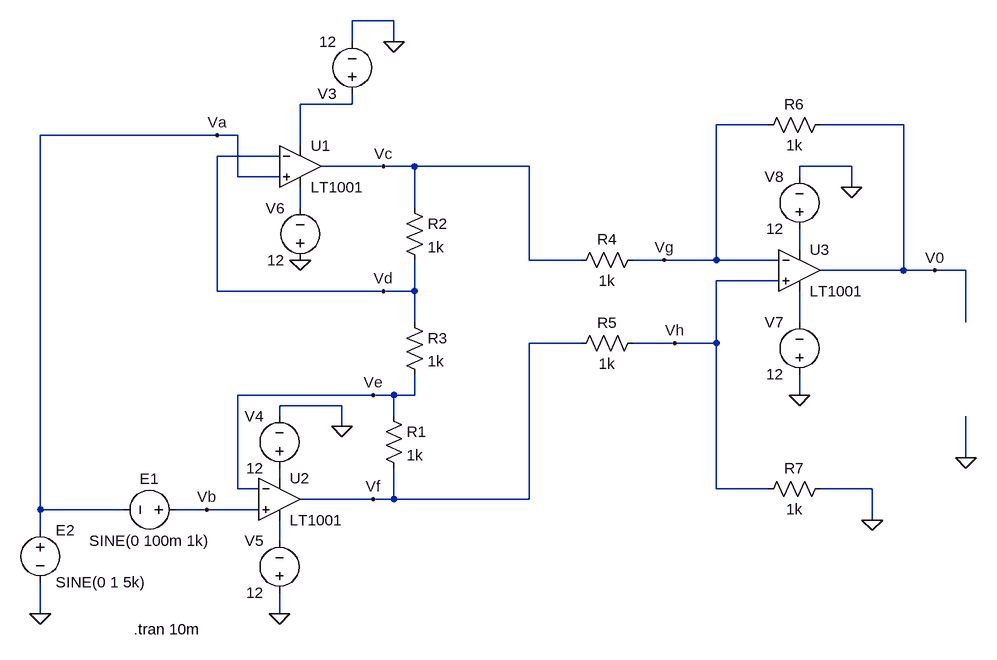
[diagram p0: schematic expt7_EEE270_AC.asc]
expt7_EEE270_AC.asc, the LTspice schematic file:
Version 4
SHEET 1 1332 680
WIRE 432 -384 368 -384
WIRE 368 -352 368 -384
WIRE 432 -352 432 -384
WIRE 368 -256 368 -272
WIRE 368 -256 288 -256
WIRE 1008 -224 928 -224
WIRE 1216 -224 1088 -224
WIRE 160 -208 -112 -208
WIRE 192 -208 160 -208
WIRE 288 -192 288 -256
WIRE 256 -176 160 -176
WIRE 416 -160 320 -160
WIRE 464 -160 416 -160
WIRE 640 -160 464 -160
WIRE 1136 -160 1056 -160
WIRE 192 -144 192 -208
WIRE 256 -144 192 -144
WIRE 1056 -144 1056 -160
WIRE 1136 -128 1136 -160
WIRE 288 -96 288 -128
WIRE 464 -96 464 -160
WIRE 1056 -32 1056 -64
WIRE 640 -16 640 -160
WIRE 720 -16 640 -16
WIRE 848 -16 800 -16
WIRE 928 -16 928 -224
WIRE 928 -16 848 -16
WIRE 1024 -16 928 -16
WIRE 1216 0 1216 -224
WIRE 1216 0 1088 0
WIRE 1264 0 1216 0
WIRE 1312 0 1264 0
WIRE 1024 16 928 16
WIRE 160 32 160 -176
WIRE 416 32 160 32
WIRE 464 32 464 -16
WIRE 464 32 416 32
WIRE 464 80 464 32
WIRE 1056 80 1056 32
WIRE 1312 80 1312 0
WIRE 720 112 640 112
WIRE 864 112 800 112
WIRE 928 112 928 16
WIRE 928 112 864 112
WIRE 400 192 192 192
WIRE 432 192 400 192
WIRE 464 192 464 160
WIRE 464 192 432 192
WIRE 1056 192 1056 160
WIRE 352 208 256 208
WIRE 256 224 256 208
WIRE 432 224 432 192
WIRE 352 240 352 208
WIRE 1312 288 1312 224
WIRE 256 320 256 304
WIRE 192 336 192 192
WIRE 224 336 192 336
WIRE 928 336 928 112
WIRE 1008 336 928 336
WIRE 1168 336 1088 336
WIRE 400 352 288 352
WIRE 432 352 432 304
WIRE 432 352 400 352
WIRE 640 352 640 112
WIRE 640 352 432 352
WIRE -112 368 -112 -208
WIRE 16 368 -112 368
WIRE 144 368 96 368
WIRE 224 368 144 368
WIRE 1168 384 1168 336
WIRE -112 400 -112 368
WIRE 256 416 256 384
WIRE -112 528 -112 480
WIRE 256 528 256 496
FLAG -112 528 0
FLAG 256 528 0
FLAG 288 -16 0
FLAG 432 -352 0
FLAG 352 240 0
FLAG 1168 384 0
FLAG 1312 288 0
FLAG 1136 -128 0
FLAG 1056 192 0
FLAG 160 -208 Va
FLAG 144 368 Vb
FLAG 416 -160 Vc
FLAG 416 32 Vd
FLAG 400 192 Ve
FLAG 400 352 Vf
FLAG 848 -16 Vg
FLAG 864 112 Vh
FLAG 1264 0 V0
SYMBOL voltage -112 384 R0
WINDOW 123 0 0 Left 0
WINDOW 39 0 0 Left 0
SYMATTR InstName E2
SYMATTR Value SINE(0 1 5k)
SYMBOL voltage 112 368 R90
WINDOW 0 -32 56 VBottom 2
WINDOW 3 32 56 VTop 2
WINDOW 123 0 0 Left 0
WINDOW 39 0 0 Left 0
SYMATTR InstName E1
SYMATTR Value SINE(0 100m 1k)
SYMBOL voltage 368 -256 R180
WINDOW 123 0 0 Left 0
WINDOW 39 0 0 Left 0
SYMATTR InstName V3
SYMATTR Value 12
SYMBOL voltage 256 320 R180
WINDOW 0 24 96 Left 2
WINDOW 3 24 16 Left 2
WINDOW 123 0 0 Left 0
WINDOW 39 0 0 Left 0
SYMATTR InstName V4
SYMATTR Value 12
SYMBOL voltage 256 512 R180
WINDOW 0 24 96 Left 2
WINDOW 3 24 16 Left 2
WINDOW 123 0 0 Left 0
WINDOW 39 0 0 Left 0
SYMATTR InstName V5
SYMATTR Value 12
SYMBOL voltage 288 0 R180
WINDOW 0 24 96 Left 2
WINDOW 3 24 16 Left 2
WINDOW 123 0 0 Left 0
WINDOW 39 0 0 Left 0
SYMATTR InstName V6
SYMATTR Value 12
SYMBOL res 416 208 R0
SYMATTR InstName R1
SYMATTR Value 1k
SYMBOL res 448 -112 R0
SYMATTR InstName R2
SYMATTR Value 1k
SYMBOL res 448 64 R0
SYMATTR InstName R3
SYMATTR Value 1k
SYMBOL res 816 -32 R90
WINDOW 0 0 56 VBottom 2
WINDOW 3 32 56 VTop 2
SYMATTR InstName R4
SYMATTR Value 1k
SYMBOL res 816 96 R90
WINDOW 0 0 56 VBottom 2
WINDOW 3 32 56 VTop 2
SYMATTR InstName R5
SYMATTR Value 1k
SYMBOL res 1104 -240 R90
WINDOW 0 0 56 VBottom 2
WINDOW 3 32 56 VTop 2
SYMATTR InstName R6
SYMATTR Value 1k
SYMBOL res 1104 320 R90
WINDOW 0 0 56 VBottom 2
WINDOW 3 32 56 VTop 2
SYMATTR InstName R7
SYMATTR Value 1k
SYMBOL voltage 1056 176 R180
WINDOW 0 24 96 Left 2
WINDOW 3 24 16 Left 2
SYMATTR InstName V7
SYMATTR Value 12
SYMBOL voltage 1056 -48 R180
WINDOW 0 24 96 Left 2
WINDOW 3 24 16 Left 2
SYMATTR InstName V8
SYMATTR Value 12
SYMBOL OpAmps\\LT1001 288 -224 R0
SYMATTR InstName U1
SYMBOL OpAmps\\LT1001 256 288 R0
SYMATTR InstName U2
SYMBOL OpAmps\\LT1001 1056 -64 R0
SYMATTR InstName U3
TEXT 32 552 Left 2 !.tran 10m

The netlist it stands for:
* expt7_EEE270_AC.asc
V§E2 Va 0 SINE(0 1 5k)
V§E1 Vb Va SINE(0 100m 1k)
V3 N001 0 12
V4 N005 0 12
V5 0 N006 12
V6 0 N002 12
R1 Ve Vf 1k
R2 Vc Vd 1k
R3 Vd Ve 1k
R4 Vg Vc 1k
R5 Vh Vf 1k
R6 V0 Vg 1k
R7 0 Vh 1k
V7 0 N004 12
V8 N003 0 12
XU1 Va Vd N001 N002 Vc LT1001  ; pins In+ In- V+ V- OUT
XU2 Vb Ve N005 N006 Vf LT1001  ; pins In+ In- V+ V- OUT
XU3 Vh Vg N003 N004 V0 LT1001  ; pins In+ In- V+ V- OUT
.tran 10m
.lib LTC.lib
.backanno
.end